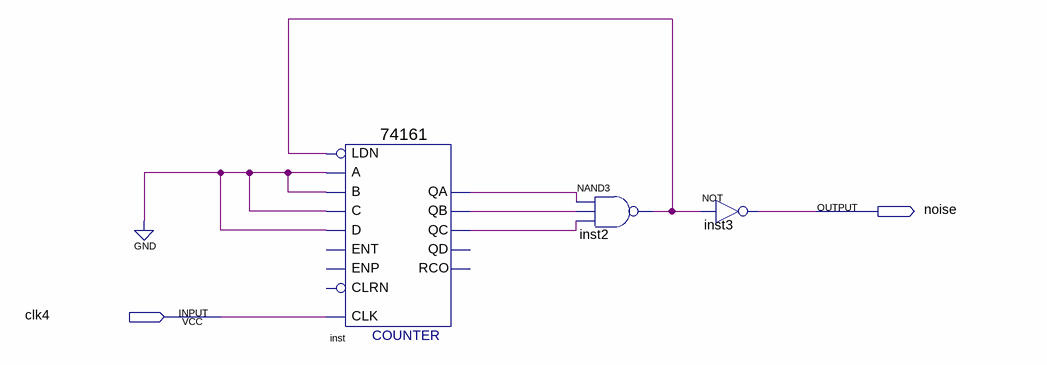
[diagram p0: schematic sheet]
// Quartus schematic noise.bdf as structural Verilog: 3 symbols, 2 pins
module noise (
  input  clk4,
  output noise
);

  wire inst2_out, inst_qa, inst_qb, inst_qc;

  \74161  inst (
    .CLK(clk4), .LDN(inst2_out), .A(1'b0), .D(1'b0), .B(1'b0), .C(1'b0), .QC(inst_qc), .QB(inst_qb),
    .QA(inst_qa));  // open: CLRN, ENP, ENT, QD, RCO
  nand inst2 (inst2_out, inst_qa, inst_qb, inst_qc);
  not inst3 (noise, inst2_out);
endmodule
